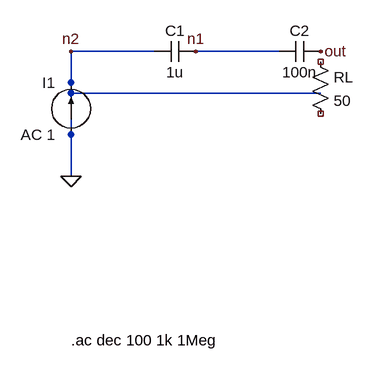
[diagram p0: schematic 00_converter_test_horizontal_cap.asc]
00_converter_test_horizontal_cap.asc, the LTspice schematic file:
Version 4
SHEET 1 880 736
WIRE 0 256 0 192
WIRE 128 192 0 192
WIRE 320 192 192 192
WIRE 384 256 0 256
WIRE 0 256 0 384
FLAG 0 384 0
FLAG 192 192 n1
FLAG 0 192 n2
FLAG 384 192 out
SYMBOL current 0 320 R180
WINDOW 0 24 80 Left 2
WINDOW 3 24 0 Left 2
SYMATTR InstName I1
SYMATTR Value AC 1
SYMBOL cap 192 176 R90
WINDOW 0 0 32 VBottom 2
WINDOW 3 32 32 VTop 2
SYMATTR InstName C1
SYMATTR Value 1u
SYMBOL cap 384 176 R90
WINDOW 0 0 32 VBottom 2
WINDOW 3 32 32 VTop 2
SYMATTR InstName C2
SYMATTR Value 100n
SYMBOL res 368 192 R0
SYMATTR InstName RL
SYMATTR Value 50
TEXT 0 636 Left 2 !.ac dec 100 1k 1Meg

The netlist it stands for:
* 00_converter_test_horizontal_cap.asc
I1 0 0 AC 1
C1 n1 0 1u
C2 out n1 100n
RL NC_01 NC_02 50
.ac dec 100 1k 1Meg
.backanno
.end